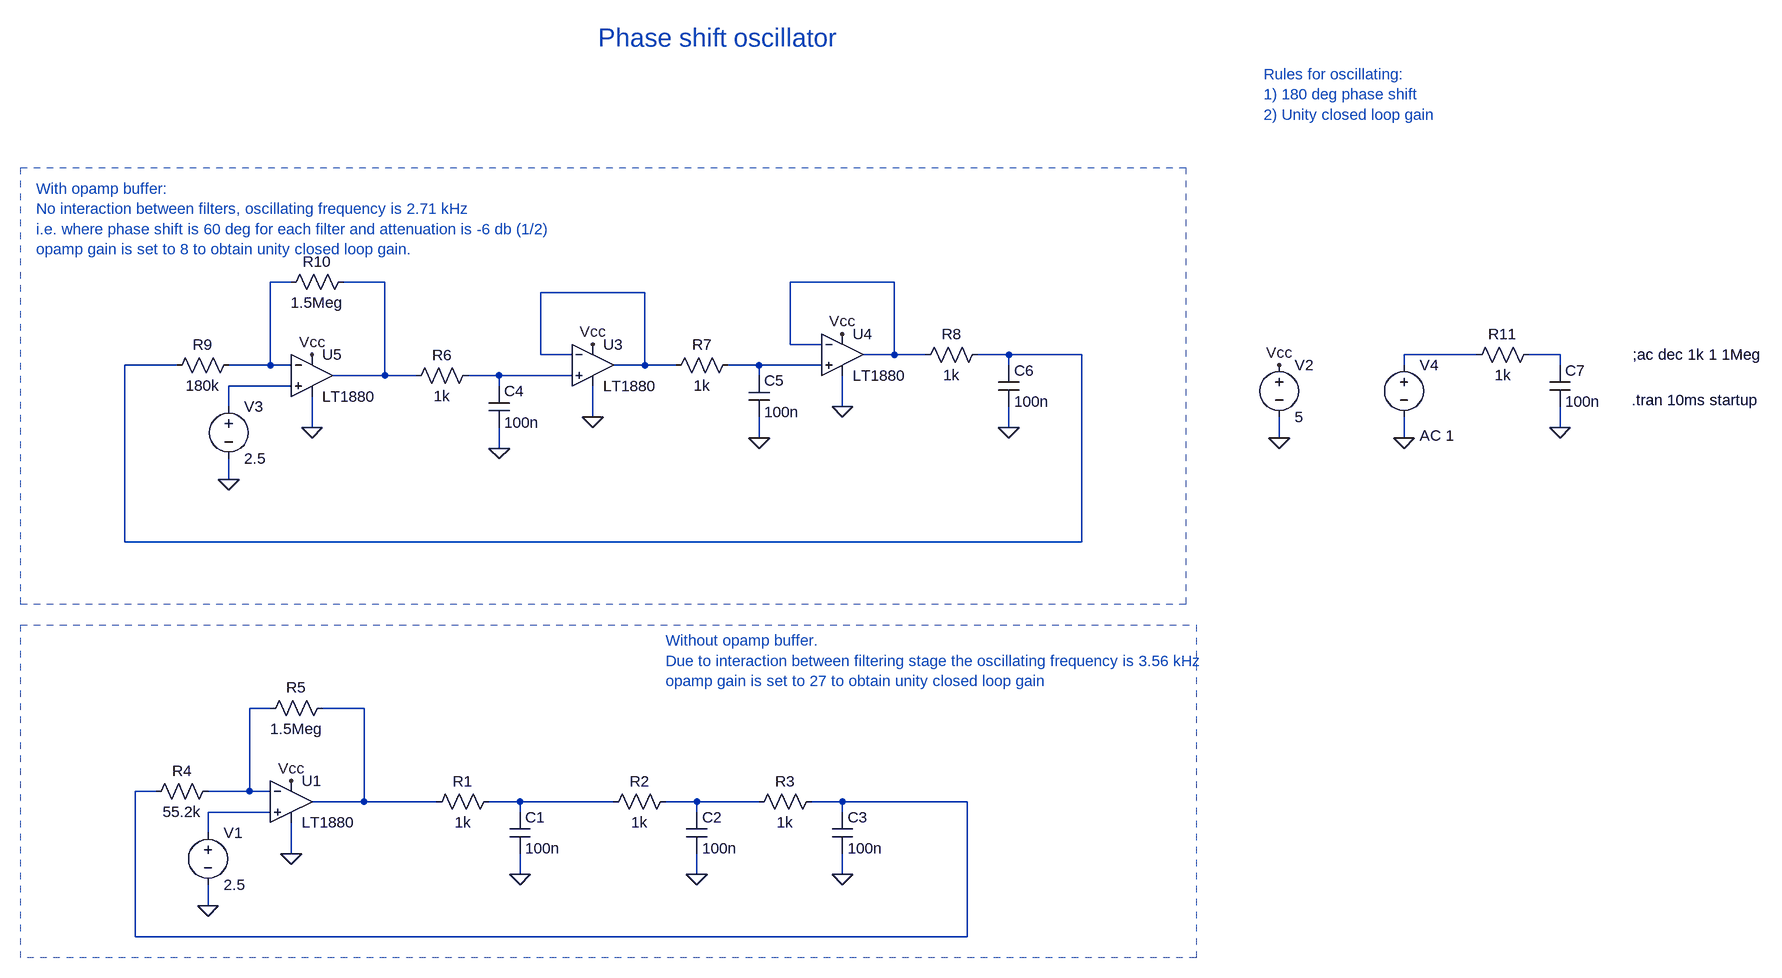
[diagram p0: schematic Phase-shift-oscillator.asc]
Phase-shift-oscillator.asc, the LTspice schematic file:
Version 4.1
SHEET 1 2240 1792
WIRE -32 160 -64 160
WIRE 112 160 48 160
WIRE 896 160 736 160
WIRE 512 176 352 176
WIRE 736 256 736 160
WIRE 784 256 736 256
WIRE 352 272 352 176
WIRE 400 272 352 272
WIRE 896 272 896 160
WIRE 896 272 848 272
WIRE 944 272 896 272
WIRE 1072 272 1024 272
WIRE 1184 272 1072 272
WIRE 1792 272 1680 272
WIRE 1920 272 1872 272
WIRE -208 288 -288 288
WIRE -64 288 -64 160
WIRE -64 288 -128 288
WIRE -32 288 -64 288
WIRE 512 288 512 176
WIRE 512 288 464 288
WIRE 560 288 512 288
WIRE 688 288 640 288
WIRE 784 288 688 288
WIRE 1072 288 1072 272
WIRE 1680 288 1680 272
WIRE 1920 288 1920 272
WIRE 112 304 112 160
WIRE 112 304 32 304
WIRE 160 304 112 304
WIRE 288 304 240 304
WIRE 400 304 288 304
WIRE 688 304 688 288
WIRE -32 320 -128 320
WIRE 288 320 288 304
WIRE -128 352 -128 320
WIRE 816 352 816 304
WIRE 432 368 432 320
WIRE 0 384 0 336
WIRE 1072 384 1072 352
WIRE 1920 384 1920 352
WIRE 688 400 688 368
WIRE 1488 400 1488 368
WIRE 1680 400 1680 368
WIRE 288 416 288 384
WIRE -128 464 -128 432
WIRE -288 560 -288 288
WIRE 1184 560 1184 272
WIRE 1184 560 -288 560
WIRE -64 816 -96 816
WIRE 80 816 16 816
WIRE -240 944 -272 944
WIRE -96 944 -96 816
WIRE -96 944 -160 944
WIRE -64 944 -96 944
WIRE 80 960 80 816
WIRE 80 960 0 960
WIRE 192 960 80 960
WIRE 320 960 272 960
WIRE 464 960 320 960
WIRE 592 960 544 960
WIRE 688 960 592 960
WIRE 816 960 768 960
WIRE 1008 960 816 960
WIRE -64 976 -160 976
WIRE 320 976 320 960
WIRE 592 976 592 960
WIRE 816 976 816 960
WIRE -160 1008 -160 976
WIRE -32 1040 -32 992
WIRE 320 1072 320 1040
WIRE 592 1072 592 1040
WIRE 816 1072 816 1040
WIRE -160 1120 -160 1088
WIRE -272 1168 -272 944
WIRE 1008 1168 1008 960
WIRE 1008 1168 -272 1168
FLAG 320 1072 0
FLAG 592 1072 0
FLAG 816 1072 0
FLAG -32 1040 0
FLAG 1488 400 0
FLAG -160 1120 0
FLAG -32 928 Vcc
FLAG 1488 288 Vcc
FLAG 288 416 0
FLAG 688 400 0
FLAG 432 368 0
FLAG 432 256 Vcc
FLAG 1072 384 0
FLAG 816 352 0
FLAG 816 240 Vcc
FLAG 0 384 0
FLAG -128 464 0
FLAG 0 272 Vcc
FLAG 1920 384 0
FLAG 1680 400 0
SYMBOL cap 304 976 R0
SYMATTR InstName C1
SYMATTR Value 100n
SYMBOL res 288 944 R90
WINDOW 0 0 56 VBottom 2
WINDOW 3 32 56 VTop 2
SYMATTR InstName R1
SYMATTR Value 1k
SYMBOL cap 576 976 R0
SYMATTR InstName C2
SYMATTR Value 100n
SYMBOL res 560 944 R90
WINDOW 0 0 56 VBottom 2
WINDOW 3 32 56 VTop 2
SYMATTR InstName R2
SYMATTR Value 1k
SYMBOL cap 800 976 R0
SYMATTR InstName C3
SYMATTR Value 100n
SYMBOL res 784 944 R90
WINDOW 0 0 56 VBottom 2
WINDOW 3 32 56 VTop 2
SYMATTR InstName R3
SYMATTR Value 1k
SYMBOL voltage -160 992 R0
WINDOW 123 0 0 Left 0
WINDOW 39 0 0 Left 0
SYMATTR InstName V1
SYMATTR Value 2.5
SYMBOL voltage 1488 272 R0
WINDOW 123 0 0 Left 0
WINDOW 39 0 0 Left 0
SYMATTR InstName V2
SYMATTR Value 5
SYMBOL res -144 928 R90
WINDOW 0 0 56 VBottom 2
WINDOW 3 32 56 VTop 2
SYMATTR InstName R4
SYMATTR Value 55.2k
SYMBOL res 32 800 R90
WINDOW 0 0 56 VBottom 2
WINDOW 3 32 56 VTop 2
SYMATTR InstName R5
SYMATTR Value 1.5Meg
SYMBOL Opamps\\LT1880 -32 960 R0
SYMATTR InstName U1
SYMBOL cap 272 320 R0
SYMATTR InstName C4
SYMATTR Value 100n
SYMBOL res 256 288 R90
WINDOW 0 0 56 VBottom 2
WINDOW 3 32 56 VTop 2
SYMATTR InstName R6
SYMATTR Value 1k
SYMBOL cap 672 304 R0
SYMATTR InstName C5
SYMATTR Value 100n
SYMBOL res 656 272 R90
WINDOW 0 0 56 VBottom 2
WINDOW 3 32 56 VTop 2
SYMATTR InstName R7
SYMATTR Value 1k
SYMBOL Opamps\\LT1880 432 288 R0
SYMATTR InstName U3
SYMBOL cap 1056 288 R0
SYMATTR InstName C6
SYMATTR Value 100n
SYMBOL res 1040 256 R90
WINDOW 0 0 56 VBottom 2
WINDOW 3 32 56 VTop 2
SYMATTR InstName R8
SYMATTR Value 1k
SYMBOL Opamps\\LT1880 816 272 R0
SYMATTR InstName U4
SYMBOL voltage -128 336 R0
WINDOW 123 0 0 Left 0
WINDOW 39 0 0 Left 0
SYMATTR InstName V3
SYMATTR Value 2.5
SYMBOL res -112 272 R90
WINDOW 0 0 56 VBottom 2
WINDOW 3 32 56 VTop 2
SYMATTR InstName R9
SYMATTR Value 180k
SYMBOL res 64 144 R90
WINDOW 0 0 56 VBottom 2
WINDOW 3 32 56 VTop 2
SYMATTR InstName R10
SYMATTR Value 1.5Meg
SYMBOL Opamps\\LT1880 0 304 R0
SYMATTR InstName U5
SYMBOL res 1888 256 R90
WINDOW 0 0 56 VBottom 2
WINDOW 3 32 56 VTop 2
SYMATTR InstName R11
SYMATTR Value 1k
SYMBOL cap 1904 288 R0
SYMATTR InstName C7
SYMATTR Value 100n
SYMBOL voltage 1680 272 R0
WINDOW 123 24 124 Left 2
WINDOW 39 0 0 Left 0
SYMATTR InstName V4
SYMATTR Value ""
SYMATTR Value2 AC 1
TEXT 2030 342 Left 2 !.tran 10ms startup
TEXT 2032 272 Left 2 !;ac dec 1k 1 1Meg
TEXT 1464 -160 Left 2 ;Rules for oscillating:\n1) 180 deg phase shift\n2) Unity closed loop gain
TEXT 440 -216 Left 4 ;Phase shift oscillator
TEXT -424 16 Left 2 ;With opamp buffer:\nNo interaction between filters, oscillating frequency is 2.71 kHz\ni.e. where phase shift is 60 deg for each filter and attenuation is -6 db (1/2)\nopamp gain is set to 8 to obtain unity closed loop gain.
TEXT 544 712 Left 2 ;Without opamp buffer.\nDue to interaction between filtering stage the oscillating frequency is 3.56 kHz\nopamp gain is set to 27 to obtain unity closed loop gain
RECTANGLE Normal 1344 656 -448 -16 2
RECTANGLE Normal 1360 1200 -448 688 2

The netlist it stands for:
* Phase-shift-oscillator.asc
C1 N014 0 100n
R1 N014 N012 1k
C2 N015 0 100n
R2 N015 N014 1k
C3 N013 0 100n
R3 N013 N015 1k
V1 N016 0 2.5
V2 Vcc 0 5
R4 N011 N013 55.2k
R5 N012 N011 1.5Meg
* U1: LT1880 (symbol Opamps\LT1880 not available, pins judged from their places): In+=N016 In-=N011 V+=Vcc V-=0 OUT=N012
C4 N009 0 100n
R6 N009 N002 1k
C5 N008 0 100n
R7 N008 N004 1k
* U3: LT1880 (symbol Opamps\LT1880 not available, pins judged from their places): In+=N009 In-=N004 V+=Vcc V-=0 OUT=N004
C6 N005 0 100n
R8 N005 N003 1k
* U4: LT1880 (symbol Opamps\LT1880 not available, pins judged from their places): In+=N008 In-=N003 V+=Vcc V-=0 OUT=N003
V3 N010 0 2.5
R9 N001 N005 180k
R10 N002 N001 1.5Meg
* U5: LT1880 (symbol Opamps\LT1880 not available, pins judged from their places): In+=N010 In-=N001 V+=Vcc V-=0 OUT=N002
R11 N007 N006 1k
C7 N007 0 100n
V4 N006 0 AC 1
.tran 10ms startup
;ac dec 1k 1 1Meg
* Rules for oscillating:
* 1) 180 deg phase shift
* 2) Unity closed loop gain
* Phase shift oscillator
* With opamp buffer:
* No interaction between filters, oscillating frequency is 2.71 kHz
* i.e. where phase shift is 60 deg for each filter and attenuation is -6 db (1/2)
* opamp gain is set to 8 to obtain unity closed loop gain.
* Without opamp buffer.
* Due to interaction between filtering stage the oscillating frequency is 3.56 kHz
* opamp gain is set to 27 to obtain unity closed loop gain
.backanno
.end